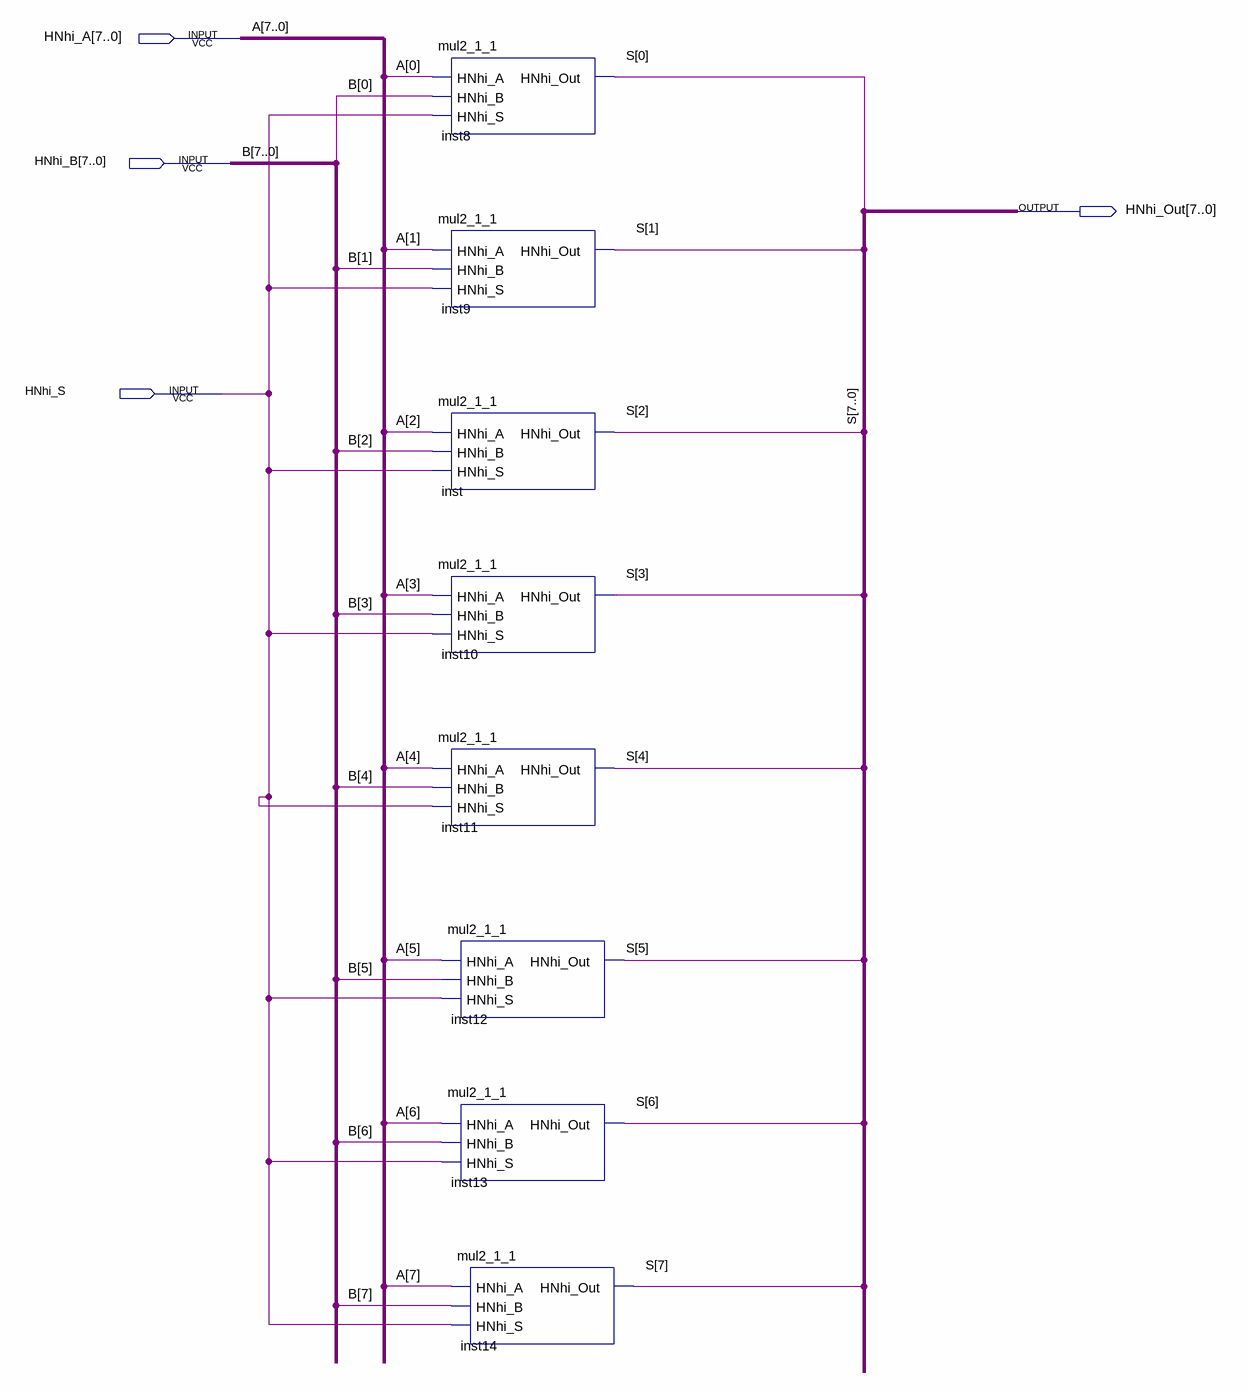
[diagram p0: schematic sheet]
// Quartus schematic mul2_1_8.bdf as structural Verilog: 8 symbols, 4 pins
module mul2_1_8 (
  input  [7:0] HNhi_A,
  input  [7:0] HNhi_B,
  input  HNhi_S,
  output [7:0] HNhi_Out
);

  mul2_1_1 inst8 (.HNhi_A(HNhi_A[0]), .HNhi_B(HNhi_B[0]), .HNhi_S(HNhi_S), .HNhi_Out(HNhi_Out[0]));
  mul2_1_1 inst9 (.HNhi_A(HNhi_A[1]), .HNhi_B(HNhi_B[1]), .HNhi_S(HNhi_S), .HNhi_Out(HNhi_Out[1]));
  mul2_1_1 inst (.HNhi_A(HNhi_A[2]), .HNhi_B(HNhi_B[2]), .HNhi_S(HNhi_S), .HNhi_Out(HNhi_Out[2]));
  mul2_1_1 inst10 (.HNhi_A(HNhi_A[3]), .HNhi_B(HNhi_B[3]), .HNhi_S(HNhi_S), .HNhi_Out(HNhi_Out[3]));
  mul2_1_1 inst11 (.HNhi_A(HNhi_A[4]), .HNhi_B(HNhi_B[4]), .HNhi_S(HNhi_S), .HNhi_Out(HNhi_Out[4]));
  mul2_1_1 inst12 (.HNhi_A(HNhi_A[5]), .HNhi_B(HNhi_B[5]), .HNhi_S(HNhi_S), .HNhi_Out(HNhi_Out[5]));
  mul2_1_1 inst13 (.HNhi_A(HNhi_A[6]), .HNhi_B(HNhi_B[6]), .HNhi_S(HNhi_S), .HNhi_Out(HNhi_Out[6]));
  mul2_1_1 inst14 (.HNhi_A(HNhi_A[7]), .HNhi_B(HNhi_B[7]), .HNhi_S(HNhi_S), .HNhi_Out(HNhi_Out[7]));

  // Other names for the same wires on the sheet: A[7:0] = HNhi_A; B[7:0] = HNhi_B; S[7:0] = HNhi_Out
endmodule
